# EAGLE schematic mixer_board (EAGLE 9.4.1)
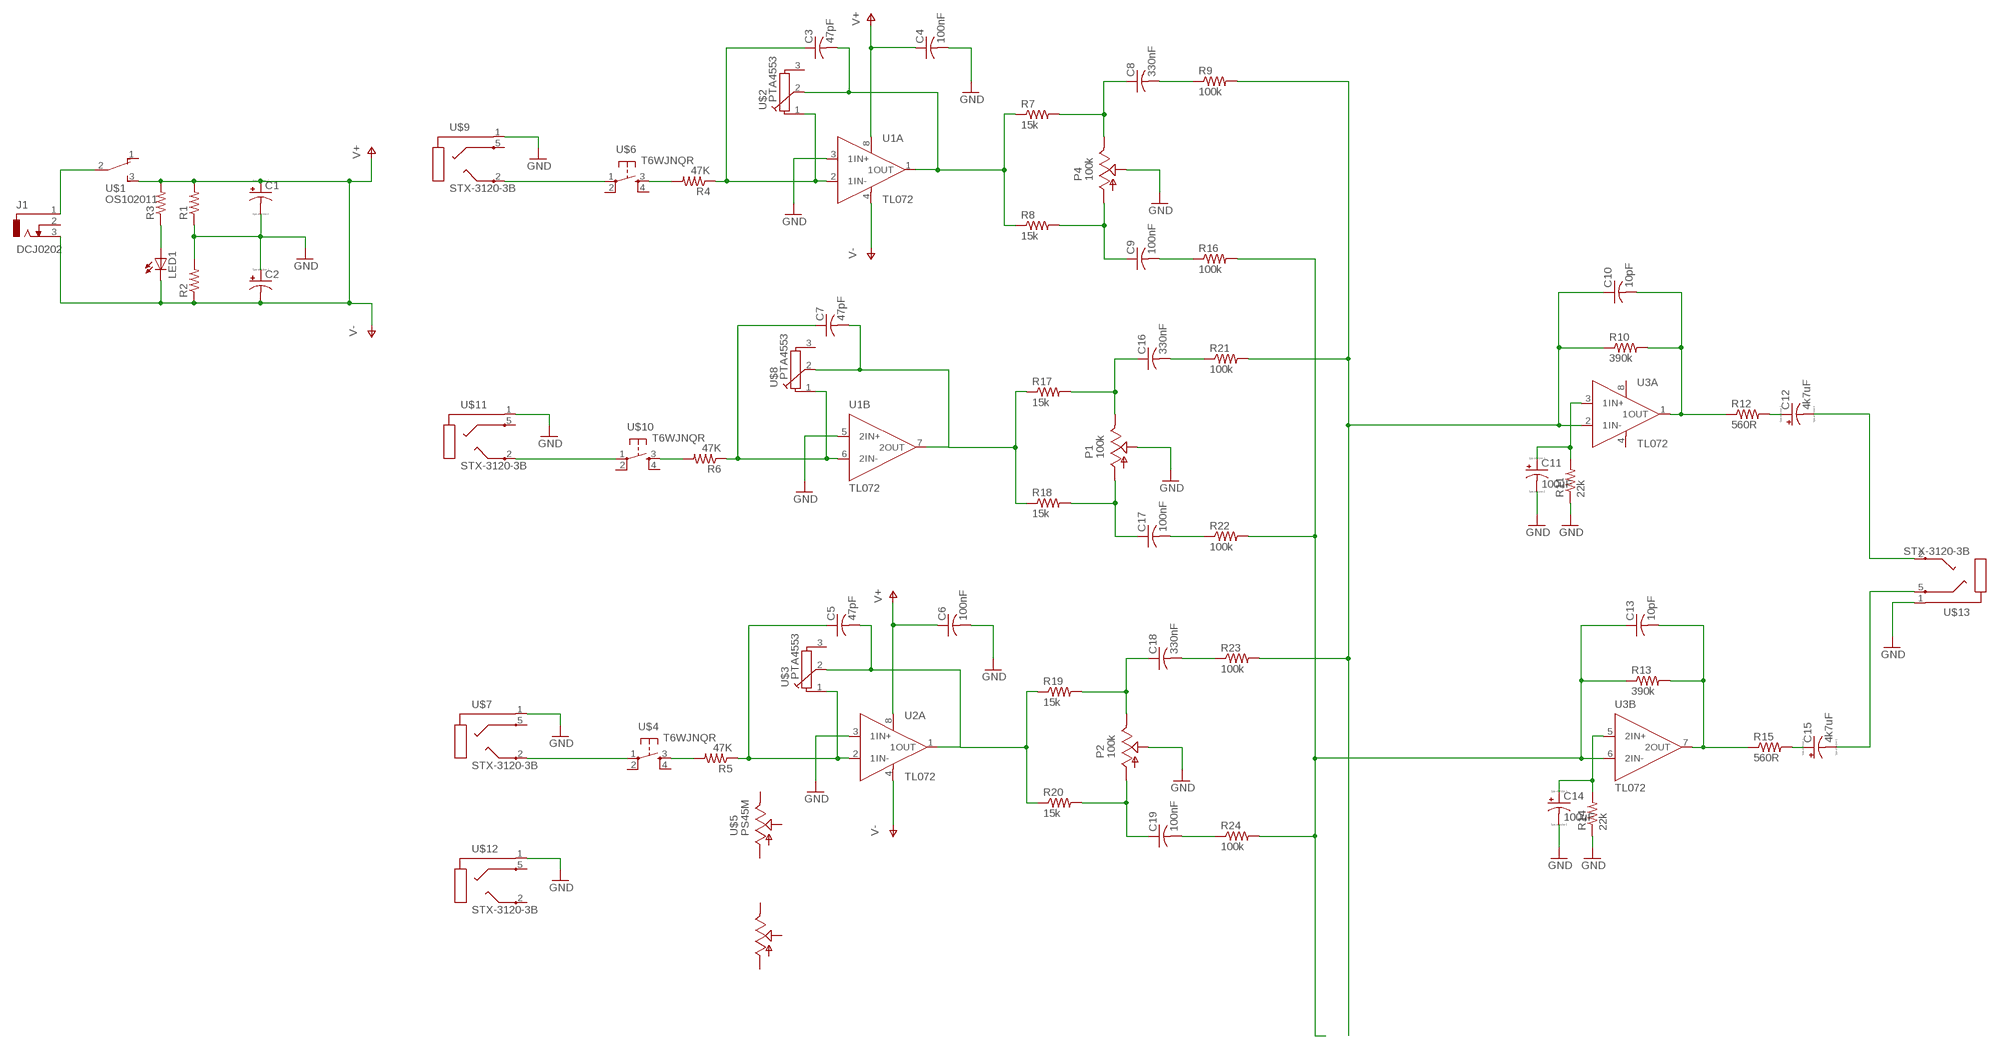
[diagram p0: schematic, sheet 1]

## Parts
C1  CPOL-US085CS-1R  [085CS_1R]
C2  CPOL-US085CS-1R  [085CS_1R]
C3  47pF  C-USC1206  [C1206]
C4  100nF  C-USC1206  [C1206]
C5  47pF  C-USC1206  [C1206]
C6  100nF  C-USC1206  [C1206]
C7  47pF  C-USC1206  [C1206]
C8  330nF  C-USC1206  [C1206]
C9  100nF  C-USC1206  [C1206]
C10  10pF  C-USC1206  [C1206]
C11  100uF  CPOL-US085CS-1R  [085CS_1R]
C12  4k7uF  CPOL-US085CS-1R  [085CS_1R]
C13  10pF  C-USC1206  [C1206]
C14  100uF  CPOL-US085CS-1R  [085CS_1R]
C15  4k7uF  CPOL-US085CS-1R  [085CS_1R]
C16  330nF  C-USC1206  [C1206]
C17  100nF  C-USC1206  [C1206]
C18  330nF  C-USC1206  [C1206]
C19  100nF  C-USC1206  [C1206]
J1  DCJ0202  [DCJ0202]
LED1  LEDCHIPLED_1206  [CHIPLED_1206]
P1  100k  PTV09A  [PTV09A]
P2  100k  PTV09A  [PTV09A]
P4  100k  PTV09A  [PTV09A]
R1  R-US_M1406  [M1406]
R2  R-US_M1406  [M1406]
R3  R-US_M1406  [M1406]
R4  47K  R-US_M1406  [M1406]
R5  47K  R-US_M1406  [M1406]
R6  47K  R-US_M1406  [M1406]
R7  15k  R-US_M1406  [M1406]
R8  15k  R-US_M1406  [M1406]
R9  100k  R-US_M1406  [M1406]
R10  390k  R-US_M1406  [M1406]
R11  22k  R-US_M1406  [M1406]
R12  560R  R-US_M1406  [M1406]
R13  390k  R-US_M1406  [M1406]
R14  22k  R-US_M1406  [M1406]
R15  560R  R-US_M1406  [M1406]
R16  100k  R-US_M1406  [M1406]
R17  15k  R-US_M1406  [M1406]
R18  15k  R-US_M1406  [M1406]
R19  15k  R-US_M1406  [M1406]
R20  15k  R-US_M1406  [M1406]
R21  100k  R-US_M1406  [M1406]
R22  100k  R-US_M1406  [M1406]
R23  100k  R-US_M1406  [M1406]
R24  100k  R-US_M1406  [M1406]
U1  TL072  [DIP794W45P254L1060H508Q8]
U2  TL072  [DIP794W45P254L1060H508Q8]
U3  TL072  [DIP794W45P254L1060H508Q8]
U$1  OS102011  [OS102011]
U$2  PTA4553  [PTA4553]
U$3  PTA4553  [PTA4553]
U$4  T6WJNQR  [T6WJ2NGQR]
U$5  PS45M  [PS45M]
U$6  T6WJNQR  [T6WJ2NGQR]
U$7  STX-3120-3B  [STX-3120]
U$8  PTA4553  [PTA4553]
U$9  STX-3120-3B  [STX-3120]
U$10  T6WJNQR  [T6WJ2NGQR]
U$11  STX-3120-3B  [STX-3120]
U$12  STX-3120-3B  [STX-3120]
U$13  STX-3120-3B  [STX-3120]

## Nets
GND: C1.- C2.+ C4.2 C6.2 C11.- C14.- P1.2 P2.2 P4.2 R1.1 R2.2 R11.1 R14.1 U1.3(A:1IN+) U1.5(B:2IN+) U2.3(A:1IN+) U$7.1 U$9.1 U$11.1 U$12.1 U$13.1
N$1: J1.1 U$1.2(P)
N$2: LED1.A R3.1
N$3: U$4.1 U$7.2
N$4: U$6.1 U$9.2
N$5: C3.1 R4.1 U1.2(A:1IN-) U$2.1(1A)
N$6: C3.2 R7.1 R8.1 U1.1(A:1OUT) U$2.2(1S)
N$7: C5.1 R5.1 U2.2(A:1IN-) U$3.1(1A)
N$8: R4.2 U$6.3
N$9: C5.2 U2.1(A:1OUT) U$3.2(1S)
N$10: R5.2 U$4.3
N$11: U$10.1 U$11.2
N$12: C7.1 R6.1 U1.6(B:2IN-) U$8.1(1A)
N$13: C7.2 U1.7(B:2OUT) U$8.2(1S)
N$14: R6.2 U$10.3
N$15: C8.2 R9.1
N$16: C8.1 P4.3 R7.2
N$17: C9.1 P4.1 R8.2
N$18: C10.1 R9.2 R10.1 R21.2 R23.2 U3.2(A:1IN-)
N$19: C10.2 R10.2 R12.1 U3.1(A:1OUT)
N$20: C12.- U$13.2
N$21: R17.1 R18.1
N$22: C11.+ R11.2 U3.3(A:1IN+)
N$23: C16.1 P1.3 R17.2
N$24: C13.2 R13.2 R15.1 U3.7(B:2OUT)
N$25: C12.+ R12.2
N$26: C14.+ R14.2 U3.5(B:2IN+)
N$27: C15.+ R15.2
N$28: C15.- U$13.5
N$29: C9.2 R16.1
N$30: C13.1 R13.1 R16.2 R22.2 R24.2 U3.6(B:2IN-)
N$31: C17.1 P1.1 R18.2
N$32: C16.2 R21.1
N$33: C17.2 R22.1
N$34: R19.1 R20.1
N$35: C18.1 P2.3 R19.2
N$36: C19.1 P2.1 R20.2
N$37: C18.2 R23.1
N$38: C19.2 R24.1
V+: C4.1 C6.1 U1.8(A:VCC+) U2.8(A:VCC+)
V-: C1.+ C2.- J1.3 LED1.C R1.2 R2.1 R3.2 U1.4(A:VCC-) U2.4(A:VCC-) U$1.3(S) ; supply symbol labelled V+
Unconnected: J1.2 U2.5(B:2IN+) U2.6(B:2IN-) U2.7(B:2OUT) U$1.1(O) U$2.3(1E) U$3.3(1E) U$4.2 U$4.4 U$5.1 U$5.1' U$5.2 U$5.2' U$5.3 U$5.3' U$6.2 U$6.4 U$7.5 U$8.3(1E) U$9.5 U$10.2 U$10.4 U$11.5 U$12.2 U$12.5

## Power pins joined to a net without a drawn wire
VCC+: U3.8(A:VCC+)
VCC-: U3.4(A:VCC-)

## Library data of the parts
C1 C2 C11 C12 C14 C15 = resistor:CPOL-US: POLARIZED CAPACITOR, American symbol
C3-C10 C13 C16-C19 = resistor:C-US: CAPACITOR, American symbol
J1 = con-jack:DCJ0202: DC POWER JACK Source: DCJ0202.pdf; OC_FARNELL: unknown; OC_NEWARK: unknown
LED1 = led:LED: LED OSRAM: - CHIPLED LG R971, LG N971, LY N971, LG Q971, LY Q971, LO R971, LY R971 LH N974, LH R974 LS Q976, LO Q976, LY Q976 LO Q996 - Hyper CHIPLED LW Q18S LB Q993, LB Q99A, LB R99A - SideLED LS A670, LO A670, LY A670, LG A670, LP A670 LB A673, LV A673, LT A673, LW A673 LH A674 LY A675 LS A676, LA A676, LO A676, LY A676, LW A676 LS A679, LY A679, LG A679 - Hyper Micro SIDELED® LS Y876, LA Y876, LO Y876, LY Y876 LT Y87S - SmartLED LW L88C, LW L88S LB L89C, LB L89S, LG L890 LS L89K, LO L89K, LY L89K LS L896, LA L896, LO L896, LY L896 - TOPLED LS T670, LO T670, LY T670, LG T670, LP T670 LSG T670, LSP T670, LSY T670, LOP T670, LYG T670 LG T671, LOG T671, LSG T671 LB T673, LV T673, LT T673, LW T673 LH T674 LS T676, LA T676, LO T676, LY T676, LB T676, LH T676, LSB T676, LW T676 LB T67C, LV T67C, LT T67C, LS T67K, LO T67K, LY T67K, LW E67C LS E67B, LA E67B, LO E67B, LY E67B, LB E67C, LV E67C, LT E67C LW T67C LS T679, LY T679, LG T679 LS T770, LO T770, LY T770, LG T770, LP T770 LB T773, LV T773, LT T773, LW T773 LH T774 LS E675, LA E675, LY E675, LS T675 LS T776, LA T776, LO T776, LY T776, LB T776 LHGB T686 LT T68C, LB T68C - Hyper Mini TOPLED® LB M676 - Mini TOPLED Santana® LG M470 LS M47K, LO M47K, LY M47K Source: http://www.osram.convergy.de LUXEON: - LUMILED® LXK2-PW12-R00, LXK2-PW12-S00, LXK2-PW14-U00, LXK2-PW14-V00 LXK2-PM12-R00, LXK2-PM12-S00, LXK2-PM14-U00 LXK2-PE12-Q00, LXK2-PE12-R00, LXK2-PE12-S00, LXK2-PE14-T00, LXK2-PE14-U00 LXK2-PB12-K00, LXK2-PB12-L00, LXK2-PB12-M00, LXK2-PB14-N00, LXK2-PB14-P00, LXK2-PB14-Q00 LXK2-PR12-L00, LXK2-PR12-M00, LXK2-PR14-Q00, LXK2-PR14-R00 LXK2-PD12-Q00, LXK2-PD12-R00, LXK2-PD12-S00 LXK2-PH12-R00, LXK2-PH12-S00 LXK2-PL12-P00, LXK2-PL12-Q00, LXK2-PL12-R00 Source: www.luxeon.com KINGBRIGHT: KA-3528ASYC Source: www.kingbright.com
P1 P2 P4 = biblib:PTV09A
R1-R24 = resistor:R-US_: RESISTOR, American symbol
U1-U3 = TL072:TL072: Wide Bandwidth Dual JFET Input Operational Amplifier 8-PDIP 0 to 70; AVAILABILITY: Unavailable; DESCRIPTION: Wide Bandwidth Dual JFET Input Operational Amplifier 8-PDIP 0 to 70; MF: STMicroelectronics; MP: TL072; PACKAGE: SOIC-8 STMicroelectronics; PRICE: None
U$1 = biblib:OS102011
U$2 U$3 U$8 = biblib:PTA4553
U$4 U$6 U$10 = biblib:T6WJNQR
U$5 = biblib:PS45M
U$7 U$9 U$11-U$13 = biblib:STX-3120-3B